# EAGLE schematic LO_FILTER_Test (EAGLE 6.2)
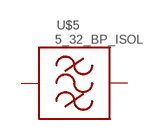
[diagram p0: schematic, sheet 1]

## Parts
U$5  5_32_BP_ISOL  [532_R4003C_508_3EC]
Unconnected: U$5.P$1 U$5.P$2

## Library data of the parts
U$5 = microstrip:5_32_BP_ISOL